# Altium project LED.PrjPcb
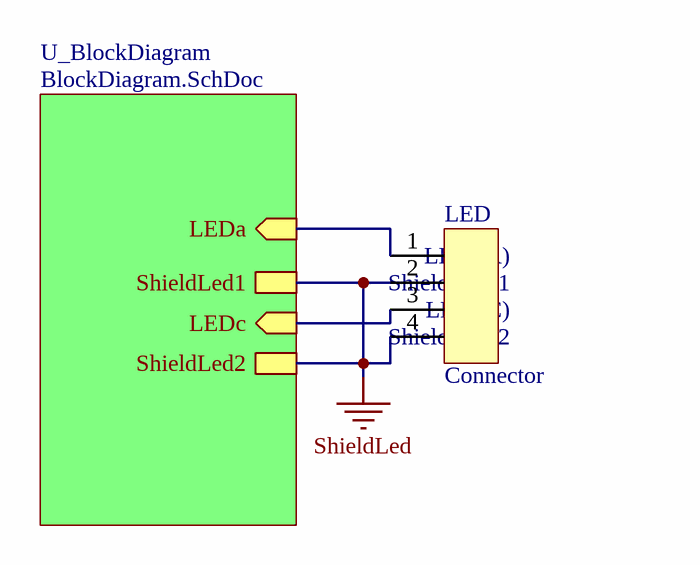
[diagram p0: LED.SchDoc]
ProjectAuthor: BKO; ProjectiAiTitle: LED; ProjectNumber: N° SGX; ProjectVersion: 1.0.0; ProjectVersionForDoc: 1_0_0
3 sheets, 1 parts. Net scope: hierarchical (ports join the sheet entries above them; power ports are global).
Board file: iAi_TemplateProject_4L.PcbDoc
Sheets:
  LED.SchDoc
    U_BlockDiagram = BlockDiagram.SchDoc
      U_BlockLED = Block_LED.SchDoc

## Sheet LED.SchDoc: <title>
size A4; Author: BKO; Organization: Institut d'Automatisation Industrielle; SheetNumber: 1; SheetTotal: 3; SVN: OUI; Version: 1.0.0; NoProject: N° SGX; ProjectTitle: LED; CurrentTime: 6; CurrentDate: 5; DocumentFullPathAndName: 8; DocumentName: 9; ModifiedDate: 13; ProjectName: <projet>

### Parts
LED  System: Connector  [MicroMatch4p]  (hidden comment: LED)

### Sub-sheets
U_BlockDiagram = BlockDiagram.SchDoc: LEDa (in), LEDc (in), ShieldLed1, ShieldLed2

### Nets
ShieldLed: LED.2 LED.4 ; sheet U_BlockDiagram/ShieldLed1, sheet U_BlockDiagram/ShieldLed2
NetLED_1: LED.1 ; sheet U_BlockDiagram/LEDa
NetLED_3: LED.3 ; sheet U_BlockDiagram/LEDc

### Notes on the sheet
- (near LED) LED (C)
- (near LED) Shield_Led1
- (near LED) LED (A)
- (near LED) Shield_Led2
- Title
- Institut d'automatisation industrielle
  rte de Cheseaux 1
  CH-1401 Yverdon-les-Bains
  T +41(0)24 55 77 377    F +41(0)24 55 76 320
  http://iai.heig-vd.ch       iai@heig-vd.ch
- Date:
- Size:
- A4
- Project:
- Sheet
- of
- No.
- Author:
- SVN
- Version
- File:

### Library data of the parts
LED = MicroMatch4p: Supplier 1: Digi-Key; Supplier Part Number 1: A107022CT-ND

## Sheet BlockDiagram.SchDoc: <title>
size A4; Author: BKO; Organization: Institut d'Automatisation Industrielle; SheetNumber: 2; SheetTotal: 3; SVN: OUI; Version: 1.0.0; NoProject: N° SGX; ProjectTitle: LED; CurrentTime: 6; CurrentDate: 5; DocumentFullPathAndName: 8; DocumentName: 9; ModifiedDate: 13; ProjectName: <projet>
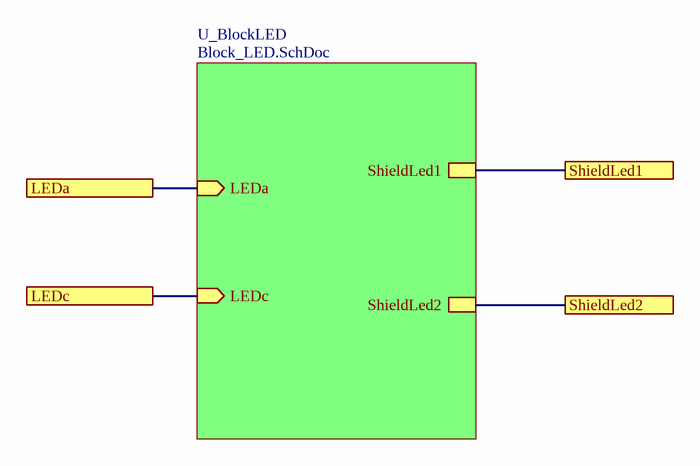
[diagram p1: BlockDiagram.SchDoc]

### Sub-sheets
U_BlockLED = Block_LED.SchDoc: ShieldLed1, ShieldLed2, LEDa (in), LEDc (in)

### Ports
LEDa, LEDc, ShieldLed1, ShieldLed2

### Nets
ShieldLed: port ShieldLed1, port ShieldLed2, sheet U_BlockLED/ShieldLed1, sheet U_BlockLED/ShieldLed2
NetLED_1: port LEDa, sheet U_BlockLED/LEDa
NetLED_3: port LEDc, sheet U_BlockLED/LEDc

### Notes on the sheet
- Title
- Institut d'automatisation industrielle
  rte de Cheseaux 1
  CH-1401 Yverdon-les-Bains
  T +41(0)24 55 77 377    F +41(0)24 55 76 320
  http://iai.heig-vd.ch       iai@heig-vd.ch
- Date:
- Size:
- A4
- Project:
- Sheet
- of
- No.
- Author:
- SVN
- Version
- File:

## Sheet Block_LED.SchDoc: <title>
size A4; Author: BKO; Organization: Institut d'Automatisation Industrielle; SheetNumber: 3; SheetTotal: 3; SVN: OUI; Version: 1.0.0; NoProject: N° SGX; ProjectTitle: LED; CurrentTime: 6; CurrentDate: 5; DocumentFullPathAndName: 8; DocumentName: 9; ModifiedDate: 13; ProjectName: <projet>

### Notes on the sheet
- Title
- Institut d'automatisation industrielle
  rte de Cheseaux 1
  CH-1401 Yverdon-les-Bains
  T +41(0)24 55 77 377    F +41(0)24 55 76 320
  http://iai.heig-vd.ch       iai@heig-vd.ch
- Date:
- Size:
- A4
- Project:
- Sheet
- of
- No.
- Author:
- SVN
- Version
- File: